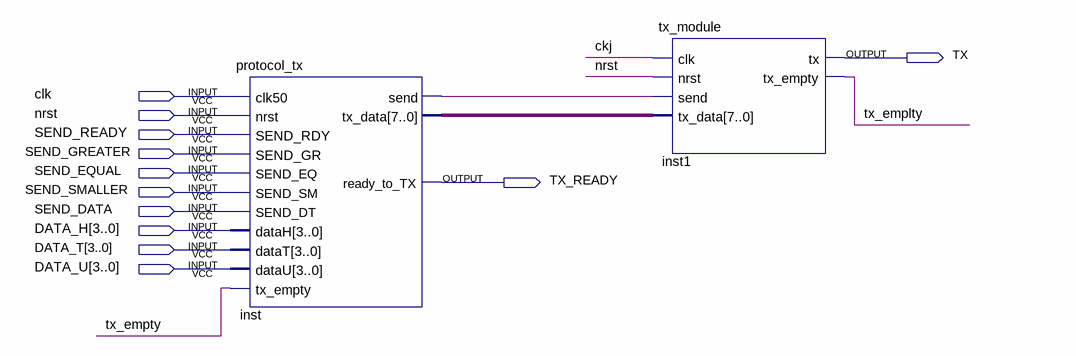
[diagram p0: schematic sheet]
// Quartus schematic TXmodule.bdf as structural Verilog: 2 symbols, 12 pins
module TXmodule (
  input  clk,
  input  nrst,
  input  SEND_READY,
  input  SEND_GREATER,
  input  SEND_EQUAL,
  input  SEND_SMALLER,
  input  SEND_DATA,
  input  [3:0] DATA_H,
  input  [3:0] DATA_T,
  input  [3:0] DATA_U,
  output TX,
  output TX_READY
);

  wire ckj, inst_send, tx_emplty, tx_empty;
  wire [7:0] inst_tx_data;

  protocol_tx inst (
    .clk50(clk), .nrst(nrst), .SEND_RDY(SEND_READY), .SEND_GR(SEND_GREATER), .SEND_EQ(SEND_EQUAL),
    .SEND_SM(SEND_SMALLER), .SEND_DT(SEND_DATA), .dataH(DATA_H), .dataT(DATA_T), .dataU(DATA_U),
    .tx_empty(tx_empty), .tx_data(inst_tx_data), .ready_to_TX(TX_READY), .send(inst_send));
  tx_module inst1 (.clk(ckj), .nrst(nrst), .send(inst_send), .tx_data(inst_tx_data), .tx(TX), .tx_empty(tx_emplty));
endmodule
